# EAGLE design OneSLiPoCharger (EAGLE 8.2.0)

## Sheet 1 of 2: Low voltage cutoff 5V regulator
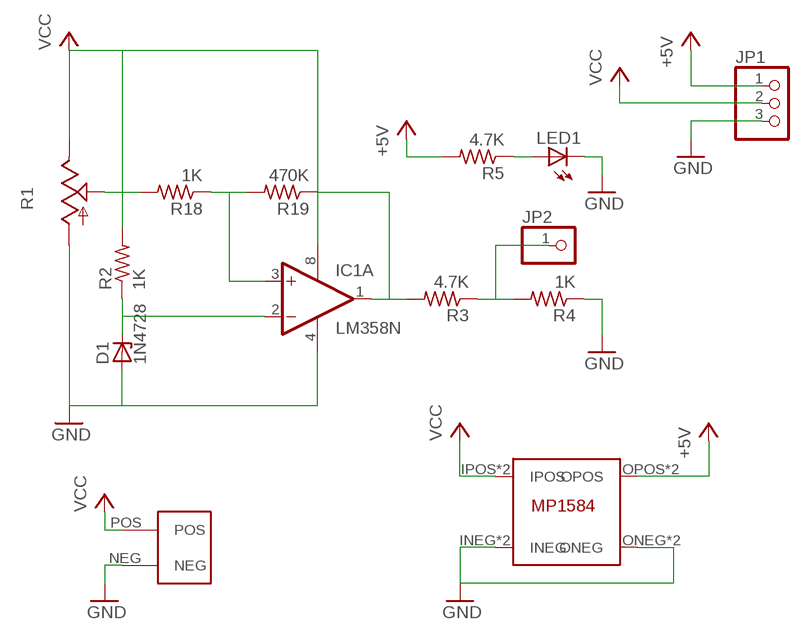
[diagram p0: schematic, sheet 1]

### Parts
D1  1N4728  [DO41Z10]
IC1  LM358N  [DIL08]
JP1  PINHD-1X3  [1X03]
JP2  PINHD-1X1  [1X01]
LED1  LED3MM  [LED3MM]
R1  TRIM_US-B25P  [B25P]
R2  1K  R-US_0207/10  [0207/10]
R3  4.7K  R-US_0207/10  [0207/10]
R4  1K  R-US_0207/10  [0207/10]
R5  4.7K  R-US_0207/10  [0207/10]
R18  1K  R-US_0207/10  [0207/10]
R19  470K  R-US_0207/10  [0207/10]
U$3  XT60  [XT60]
U$14  MP1584EN-MOD  [MP1584MOD-TH]

### Nets
+5V: JP1.1 R5.2 U$14.OPOS U$14.OPOS1(OPOS) ; also sheet 2
GND: D1.A IC1.4(P:V-) JP1.3 LED1.K(C) R1.A R4.1 U$3.NEG U$14.INEG U$14.INEG1(INEG) U$14.ONEG U$14.ONEG1(ONEG) ; also sheet 2
N$1: R1.S R18.2
N$2: JP2.1 R3.1 R4.2
N$3: D1.C IC1.2(A:-IN) R2.1
N$4: IC1.1(A:OUT) R3.2 R19.1
N$10: LED1.A R5.1
N$31: IC1.3(A:+IN) R18.1 R19.2
VCC: IC1.8(P:V+) JP1.2 R1.E R2.2 U$3.POS U$14.IPOS U$14.IPOS1(IPOS)
Unconnected: IC1.5(B:+IN) IC1.6(B:-IN) IC1.7(B:OUT)

## Sheet 2 of 2: 1S Lipo circuit
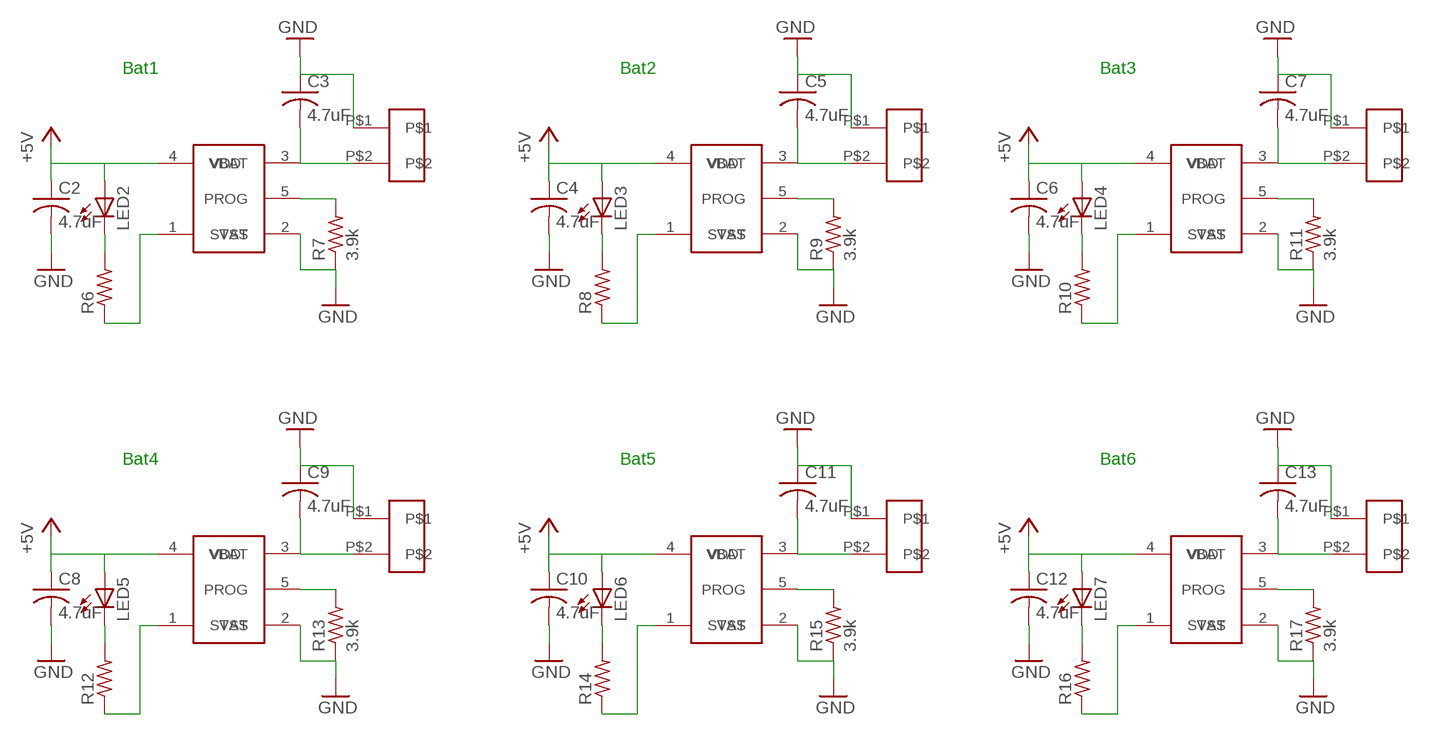
[diagram p1: schematic, sheet 2]

### Parts
C2  4.7uF  C-USC0805  [C0805]
C3  4.7uF  C-USC0805  [C0805]
C4  4.7uF  C-USC0805  [C0805]
C5  4.7uF  C-USC0805  [C0805]
C6  4.7uF  C-USC0805  [C0805]
C7  4.7uF  C-USC0805  [C0805]
C8  4.7uF  C-USC0805  [C0805]
C9  4.7uF  C-USC0805  [C0805]
C10  4.7uF  C-USC0805  [C0805]
C11  4.7uF  C-USC0805  [C0805]
C12  4.7uF  C-USC0805  [C0805]
C13  4.7uF  C-USC0805  [C0805]
LED2  LED3MM  [LED3MM]
LED3  LED3MM  [LED3MM]
LED4  LED3MM  [LED3MM]
LED5  LED3MM  [LED3MM]
LED6  LED3MM  [LED3MM]
LED7  LED3MM  [LED3MM]
R6  R-US_M0805  [M0805]
R7  3.9k  R-US_M0805  [M0805]
R8  R-US_M0805  [M0805]
R9  3.9k  R-US_M0805  [M0805]
R10  R-US_M0805  [M0805]
R11  3.9k  R-US_M0805  [M0805]
R12  R-US_M0805  [M0805]
R13  3.9k  R-US_M0805  [M0805]
R14  R-US_M0805  [M0805]
R15  3.9k  R-US_M0805  [M0805]
R16  R-US_M0805  [M0805]
R17  3.9k  R-US_M0805  [M0805]
U$1  MCP73831  [MCP73831-SOT23]
U$2  PICOBLADE-2PIN  [PICOBLADE-2PIN]
U$4  MCP73831  [MCP73831-SOT23]
U$5  PICOBLADE-2PIN  [PICOBLADE-2PIN]
U$6  MCP73831  [MCP73831-SOT23]
U$7  PICOBLADE-2PIN  [PICOBLADE-2PIN]
U$8  MCP73831  [MCP73831-SOT23]
U$9  PICOBLADE-2PIN  [PICOBLADE-2PIN]
U$10  MCP73831  [MCP73831-SOT23]
U$11  PICOBLADE-2PIN  [PICOBLADE-2PIN]
U$12  MCP73831  [MCP73831-SOT23]
U$13  PICOBLADE-2PIN  [PICOBLADE-2PIN]

### Nets
+5V: C2.1 C4.1 C6.1 C8.1 C10.1 C12.1 LED2.A LED3.A LED4.A LED5.A LED6.A LED7.A U$1.4(VDD) U$4.4(VDD) U$6.4(VDD) U$8.4(VDD) U$10.4(VDD) U$12.4(VDD) ; also sheet 1
GND: C2.2 C3.1 C4.2 C5.1 C6.2 C7.1 C8.2 C9.1 C10.2 C11.1 C12.2 C13.1 R7.1 R9.1 R11.1 R13.1 R15.1 R17.1 U$1.2(VSS) U$2.P$1 U$4.2(VSS) U$5.P$1 U$6.2(VSS) U$7.P$1 U$8.2(VSS) U$9.P$1 U$10.2(VSS) U$11.P$1 U$12.2(VSS) U$13.P$1 ; also sheet 1
N$6: LED2.K(C) R6.2
N$7: R6.1 U$1.1(STAT)
N$8: R7.2 U$1.5(PROG)
N$9: C3.2 U$1.3(VBAT) U$2.P$2
N$11: LED3.K(C) R8.2
N$12: R8.1 U$4.1(STAT)
N$13: R9.2 U$4.5(PROG)
N$14: C5.2 U$4.3(VBAT) U$5.P$2
N$15: LED4.K(C) R10.2
N$16: R10.1 U$6.1(STAT)
N$17: R11.2 U$6.5(PROG)
N$18: C7.2 U$6.3(VBAT) U$7.P$2
N$19: LED5.K(C) R12.2
N$20: R12.1 U$8.1(STAT)
N$21: R13.2 U$8.5(PROG)
N$22: C9.2 U$8.3(VBAT) U$9.P$2
N$23: LED6.K(C) R14.2
N$24: R14.1 U$10.1(STAT)
N$25: R15.2 U$10.5(PROG)
N$26: C11.2 U$10.3(VBAT) U$11.P$2
N$27: LED7.K(C) R16.2
N$28: R16.1 U$12.1(STAT)
N$29: R17.2 U$12.5(PROG)
N$30: C13.2 U$12.3(VBAT) U$13.P$2

### Notes on the sheet
- Bat1 | Bat2 | Bat3
- Bat4 | Bat5 | Bat6

## Library data of the parts
C2-C13 = rcl:C-US: CAPACITOR, American symbol
D1 = diode:1N4728: Z DIODE 3.3 V, 1W, 5 percent
IC1 = linear:LM358: OP AMP also LM158; LM258; LM2904 Source: http://cache.national.com/ds/LM/LM158.pdf
JP1 = pinhead:PINHD-1X3: PIN HEADER
JP2 = pinhead:PINHD-1X1: PIN HEADER
LED1-LED7 = led:LED: LED OSRAM: - CHIPLED LG R971, LG N971, LY N971, LG Q971, LY Q971, LO R971, LY R971 LH N974, LH R974 LS Q976, LO Q976, LY Q976 LO Q996 - Hyper CHIPLED LW Q18S LB Q993, LB Q99A, LB R99A - SideLED LS A670, LO A670, LY A670, LG A670, LP A670 LB A673, LV A673, LT A673, LW A673 LH A674 LY A675 LS A676, LA A676, LO A676, LY A676, LW A676 LS A679, LY A679, LG A679 - Hyper Micro SIDELED® LS Y876, LA Y876, LO Y876, LY Y876 LT Y87S - SmartLED LW L88C, LW L88S LB L89C, LB L89S, LG L890 LS L89K, LO L89K, LY L89K LS L896, LA L896, LO L896, LY L896 - TOPLED LS T670, LO T670, LY T670, LG T670, LP T670 LSG T670, LSP T670, LSY T670, LOP T670, LYG T670 LG T671, LOG T671, LSG T671 LB T673, LV T673, LT T673, LW T673 LH T674 LS T676, LA T676, LO T676, LY T676, LB T676, LH T676, LSB T676, LW T676 LB T67C, LV T67C, LT T67C, LS T67K, LO T67K, LY T67K, LW E67C LS E67B, LA E67B, LO E67B, LY E67B, LB E67C, LV E67C, LT E67C LW T67C LS T679, LY T679, LG T679 LS T770, LO T770, LY T770, LG T770, LP T770 LB T773, LV T773, LT T773, LW T773 LH T774 LS E675, LA E675, LY E675, LS T675 LS T776, LA T776, LO T776, LY T776, LB T776 LHGB T686 LT T68C, LB T68C - Hyper Mini TOPLED® LB M676 - Mini TOPLED Santana® LG M470 LS M47K, LO M47K, LY M47K Source: http://www.osram.convergy.de LUXEON: - LUMILED® LXK2-PW12-R00, LXK2-PW12-S00, LXK2-PW14-U00, LXK2-PW14-V00 LXK2-PM12-R00, LXK2-PM12-S00, LXK2-PM14-U00 LXK2-PE12-Q00, LXK2-PE12-R00, LXK2-PE12-S00, LXK2-PE14-T00, LXK2-PE14-U00 LXK2-PB12-K00, LXK2-PB12-L00, LXK2-PB12-M00, LXK2-PB14-N00, LXK2-PB14-P00, LXK2-PB14-Q00 LXK2-PR12-L00, LXK2-PR12-M00, LXK2-PR14-Q00, LXK2-PR14-R00 LXK2-PD12-Q00, LXK2-PD12-R00, LXK2-PD12-S00 LXK2-PH12-R00, LXK2-PH12-S00 LXK2-PL12-P00, LXK2-PL12-Q00, LXK2-PL12-R00 Source: www.luxeon.com KINGBRIGHT: KA-3528ASYC Source: www.kingbright.com
R1 = pot:TRIM_US-: POTENTIOMETER
R2-R19 = rcl:R-US_: RESISTOR, American symbol
U$1 U$4 U$6 U$8 U$10 U$12 = MCP73831:MCP73831
U$2 U$5 U$7 U$9 U$11 U$13 = Picoblade:PICOBLADE-2PIN
U$3 = XTConnector:XT60
U$14 = VRegModules:MP1584EN-MOD

## Board
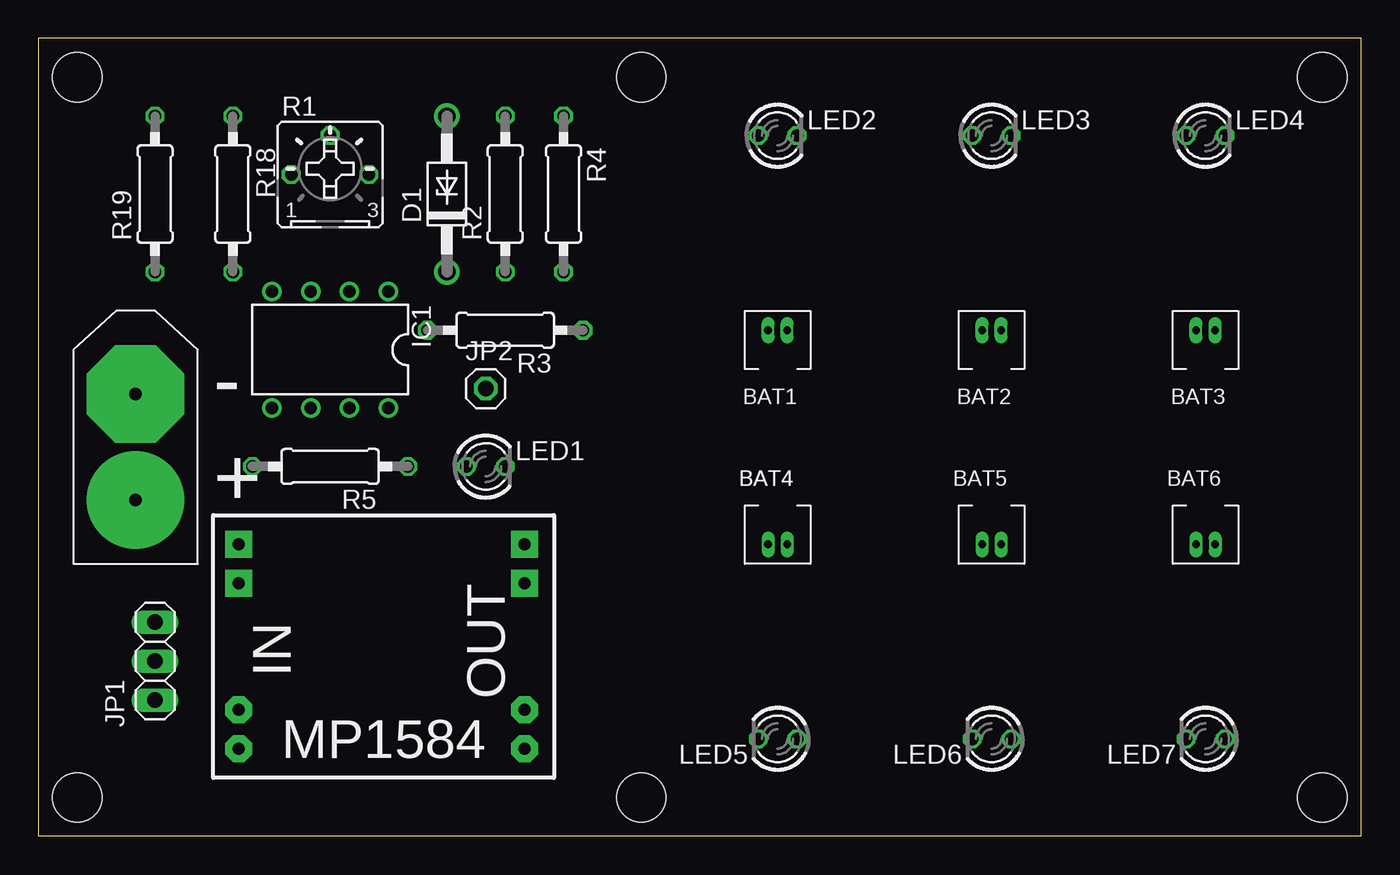
[diagram p2: board, top side]
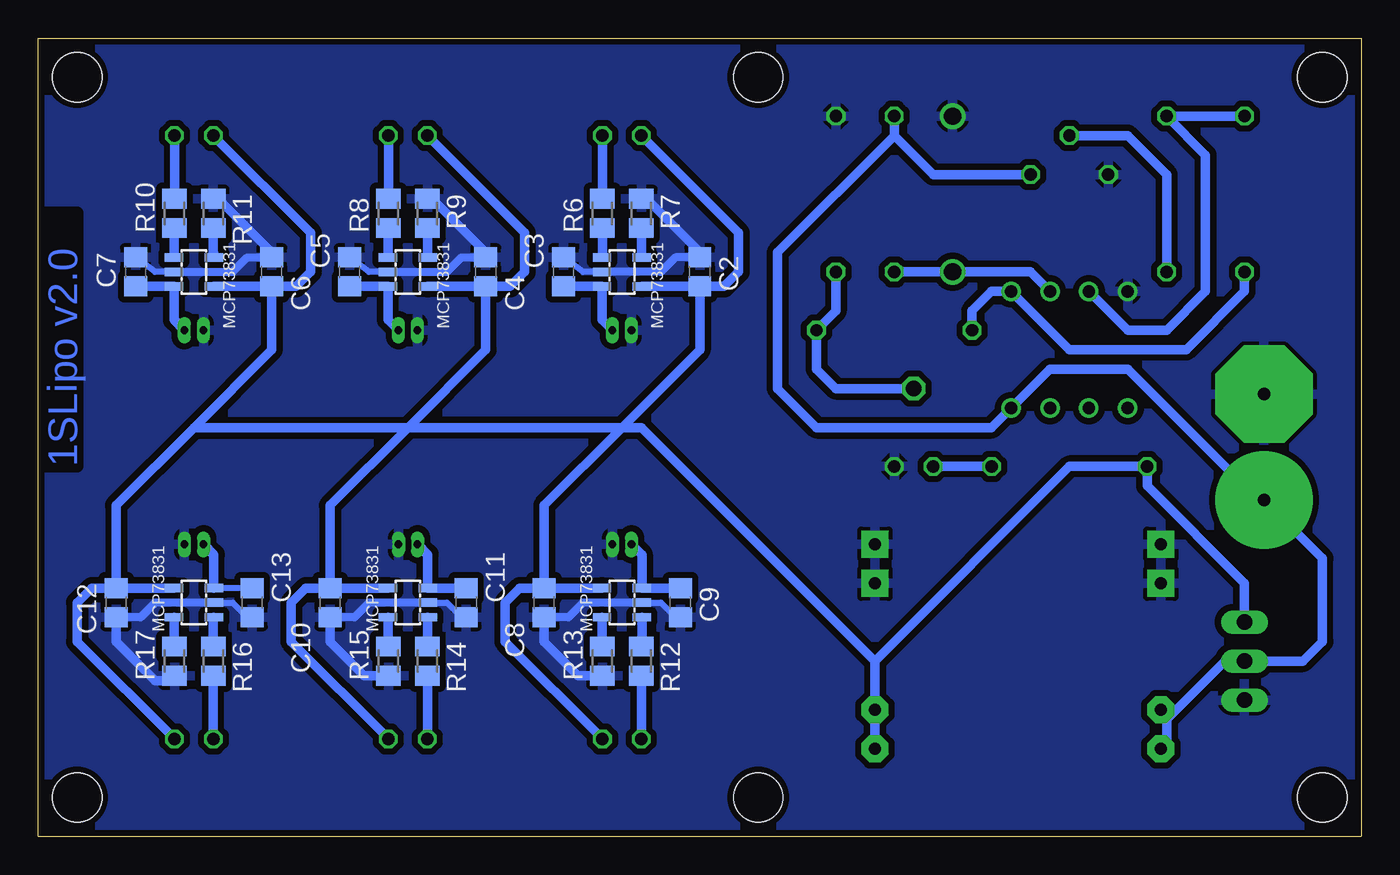
[diagram p3: board, bottom side, seen from below]

Size 86.36 x 52.07 mm. Coordinates in mm from the lower left corner, seen from the top.
Outline: 86.36,0 86.36,52.07 0,52.07 0,0 86.36,0
Copper layers (1*16): Top 0.0356mm / dielectric 1.5011mm / Bottom 0.0356mm
Design rules "LaenPCBOrder": minimum track width 6mil, minimum drill 13mil, track to track 6mil, track to pad 6mil, pad to pad 6mil, via to via 6mil, smd to smd 6mil, copper to edge 15mil, drill to drill 6mil, minimum pad ring 7mil, minimum via ring 7mil, stop-mask expansion 3mil, vias tented up to drill 0mil, thermal gap 10mil
Holes 3.2 mm at 2.54,2.54 2.54,49.53 83.82,49.53 83.82,2.54 39.37,49.53 39.37,2.54

### Footprints (pad centres in the part's own frame; a part is rotated, then mirrored left to right if it is on the bottom)
C0805 = smd 1.3 x 1.5: 1 -0.95,0; 2 0.95,0
DO41Z10 = drill 1.118: A 5.08,0; C -5.08,0
DIL08 = drill 0.813 pad 1.27: 1 -3.81,-3.81; 2 -1.27,-3.81; 3 1.27,-3.81; 4 3.81,-3.81; 5 3.81,3.81; 6 1.27,3.81; 7 -1.27,3.81; 8 -3.81,3.81
1X03 = drill 1.016 long: 1 -2.54,0; 2 0,0; 3 2.54,0
1X01 = drill 1.016 octagon: 1 0,0
LED3MM = drill 0.813 octagon: A -1.27,0; K 1.27,0
B25P = drill 0.813 octagon: A -2.54,0; E 2.54,0; S 0,2.54
0207/10 = drill 0.813 octagon: 1 -5.08,0; 2 5.08,0
M0805 = smd 1.3 x 1.6: 1 -0.95,0; 2 0.95,0
MCP73831-SOT23 = smd 0.55 x 1.2: 1 -0.95,-1.3; 2 0,-1.3; 3 0.95,-1.3; 4 0.95,1.3; 5 -0.95,1.3
PICOBLADE-2PIN = drill 0.5 pad 0.711 long: P$1 -0.625,0; P$2 0.625,0
XT60 = drill 0.8 pad 6.35 octagon: NEG 0,3.454 | drill 0.8 pad 6.35: POS 0,-3.454
MP1584MOD-TH = drill 0.8 pad 1.778 square: INEG 18.669,0; INEG1 18.669,2.54; ONEG 0,0; ONEG1 0,2.54 | drill 0.8 pad 1.778 octagon: IPOS 18.669,13.335; IPOS1 18.669,10.795; OPOS 0,13.335; OPOS1 0,10.795

### Placement (x,y rotation side)
C2  43.18,36.83 90 bottom
C3  52.07,36.83 270 bottom
C4  57.15,36.83 90 bottom
C5  66.04,36.83 270 bottom
C6  71.12,36.83 90 bottom
C7  80.01,36.83 270 bottom
C8  53.34,15.24 270 bottom
C9  44.45,15.24 90 bottom
C10  67.31,15.24 270 bottom
C11  58.42,15.24 90 bottom
C12  81.28,15.24 270 bottom
C13  72.39,15.24 90 bottom
D1  26.67,41.91 90 top
DRILEGEND  [DRILEGEND]  -17.78,-9.8 0 top  (outside the outline)
IC1  19.05,31.75 180 top
JP1  7.62,11.43 270 top
JP2  29.21,29.21 0 top
LED1  29.21,24.13 0 top
LED2  48.26,45.72 0 top
LED3  62.23,45.72 0 top
LED4  76.2,45.72 0 top
LED5  48.26,6.35 180 top
LED6  62.23,6.35 180 top
LED7  76.2,6.35 180 top
R1  19.05,43.18 0 top
R2  30.48,41.91 90 top
R3  30.48,33.02 180 top
R4  34.29,41.91 270 top
R5  19.05,24.13 180 top
R6  49.53,40.64 90 bottom
R7  46.99,40.64 270 bottom
R8  63.5,40.64 90 bottom
R9  60.96,40.64 270 bottom
R10  77.47,40.64 90 bottom
R11  74.93,40.64 270 bottom
R12  46.99,11.43 270 bottom
R13  49.53,11.43 90 bottom
R14  60.96,11.43 270 bottom
R15  63.5,11.43 90 bottom
R16  74.93,11.43 270 bottom
R17  77.47,11.43 90 bottom
R18  12.7,41.91 270 top
R19  7.62,41.91 90 top
U$1  48.26,36.83 270 bottom
U$2  48.26,33.02 0 top
U$3  6.35,25.4 0 top
U$4  62.23,36.83 270 bottom
U$5  62.23,33.02 0 top
U$6  76.2,36.83 270 bottom
U$7  76.2,33.02 0 top
U$8  48.26,15.24 90 bottom
U$9  48.26,19.05 180 top
U$10  62.23,15.24 90 bottom
U$11  62.23,19.05 180 top
U$12  76.2,15.24 90 bottom
U$13  76.2,19.05 180 top
U$14  31.75,19.05 180 top

### Tracks (layer width: path | path; a pad name or v marks a point on that pad's centre or on a via)
+5V
  Bottom 0.61: C2.1 U$1.4 | LED2.A 40.64,39.37 40.64,36.83 41.59,35.88 C2.1 | C4.1 U$4.4 | LED3.A 54.61,39.37 54.61,36.83 55.56,35.88 C4.1 | U$6.4 C6.1 | LED4.A 68.58,39.37 68.58,36.83 69.53,35.88 C6.1 | C8.1 U$8.4 | C8.1 54.93,16.19 55.88,15.24 55.88,12.7 LED5.A | U$10.4 C10.1 | C10.1 68.9,16.19 69.85,15.24 69.85,12.7 LED6.A | U$12.4 C12.1 | C12.1 82.87,16.19 83.82,15.24 83.82,12.7 LED7.A | C8.1 53.34,21.59 48.26,26.67 | C12.1 81.28,21.59 76.2,26.67 | C6.1 71.12,31.75 76.2,26.67 | C10.1 67.31,21.59 62.23,26.67 | C4.1 57.15,31.75 62.23,26.67 | 76.2,26.67 62.23,26.67 | C2.1 43.18,31.75 48.26,26.67 | 48.26,26.67 62.23,26.67 | 48.26,26.67 46.99,26.67 31.75,11.43 | JP1.1 7.62,16.51 13.97,22.86 R5.2 19.05,24.13 31.75,11.43 | 31.75,11.43 U$14.OPOS1 U$14.OPOS
GND
  Bottom 0.406: U$1.2 50.8,36.83 C3.1 | U$4.2 64.77,36.83 C5.1 | U$6.2 78.74,36.83 C7.1 | U$12.2 73.66,15.24 72.71,14.29 | U$10.2 59.69,15.24 58.74,14.29 | U$8.2 45.72,15.24 44.77,14.29
  Bottom 0.508: C2.2 44.77,37.78 45.72,36.83 U$1.2 | U$4.2 59.69,36.83 58.74,37.78 C4.2 | U$6.2 73.66,36.83 72.71,37.78 C6.2 | U$10.2 64.77,15.24 65.72,14.29 C10.2 | U$12.2 78.74,15.24 79.69,14.29 C12.2 | U$8.2 50.8,15.24 51.75,14.29 C8.2
  Bottom 0.61: R7.1 46.67,41.59 43.18,38.1 C2.2 | C4.2 57.15,38.1 60.64,41.59 R9.1 | C6.2 71.12,38.1 74.61,41.59 R11.1 | 81.28,13.97 C12.2 81.28,12.7 78.74,10.16 77.79,10.16 R17.1 77.47,10.16 | 72.71,14.29 C13.1 | 58.74,14.29 C11.1 | C10.2 67.31,12.7 65.09,10.48 R15.1 | 44.77,14.29 C9.1 | C8.2 53.34,12.7 51.12,10.48 R13.1
  pour Bottom (isolate 0.406): 0,0 86.36,0 86.36,52.07 0,52.07
N$1
  Bottom 0.61: R18.2 12.7,43.18 15.24,45.72 R1.S
N$2
  Bottom 0.61: R4.2 34.29,34.29 R3.1 35.56,30.48 34.29,29.21 JP2.1
N$3
  Bottom 0.61: IC1.2 21.59,36.83 D1.C R2.1
N$4
  Bottom 0.61: R19.1 7.62,35.56 11.43,31.75 19.05,31.75 IC1.1 24.13,35.56 25.4,34.29 R3.2
N$6
  Bottom 0.61: LED2.K R6.2
N$7
  Bottom 0.61: U$1.1 49.53,37.81 R6.1
N$8
  Bottom 0.61: U$1.5 46.99,37.81 R7.2
N$9
  Bottom 0.61: C3.2 U$1.3 49.56,33.7 U$2.P$2
N$10
  Bottom 0.61: R5.1 LED1.A
N$11
  Bottom 0.61: LED3.K R8.2
N$12
  Bottom 0.61: R8.1 63.53,39.69 U$4.1
N$13
  Bottom 0.406: R9.2 60.93,39.69
  Bottom 0.61: 60.93,39.69 U$4.5
N$14
  Bottom 0.61: 66.04,35.56 C5.2 U$4.3 63.53,33.7 U$5.P$2
N$15
  Bottom 0.61: LED4.K R10.2
N$16
  Bottom 0.61: R10.1 77.5,39.66 U$6.1
N$17
  Bottom 0.61: U$6.5 74.9,38.07 74.93,38.1 R11.2
N$18
  Bottom 0.61: C7.2 U$6.3 77.5,33.7 U$7.P$2
N$19
  Bottom 0.61: LED5.K R12.2
N$20
  Bottom 0.61: R12.1 46.96,12.41 U$8.1
N$21
  Bottom 0.61: U$8.5 49.56,12.38 R13.2
N$22
  Bottom 0.61: U$9.P$2 46.96,18.38 U$8.3 C9.2
N$23
  Bottom 0.61: LED6.K R14.2
N$24
  Bottom 0.61: R14.1 60.96,14.26 U$10.1
N$25
  Bottom 0.61: U$10.5 63.53,12.41 R15.2
N$26
  Bottom 0.61: U$11.P$2 60.93,18.38 U$10.3 C11.2
N$27
  Bottom 0.61: LED7.K R16.2
N$28
  Bottom 0.61: R16.1 74.93,14.26 U$12.1
N$29
  Bottom 0.61: U$12.5 77.5,12.41 R17.2
N$30
  Bottom 0.406: C13.2 U$12.3
  Bottom 0.61: U$12.3 74.9,18.38 U$13.P$2
N$31
  Bottom 0.61: R19.2 R18.1 10.16,44.45 10.16,35.56 12.7,33.02 15.24,33.02 IC1.3
VCC
  Bottom 0.61: R1.E 27.94,43.18 30.48,45.72 | 12.7,7.62 8.89,11.43 JP1.2 3.81,11.43 2.54,12.7 2.54,18.14 U$3.POS 6.71,21.95 15.24,30.48 20.32,30.48 IC1.8 24.13,26.67 35.56,26.67 38.1,29.21 38.1,38.1 30.48,45.72 | 12.7,7.62 12.7,6.35 U$14.IPOS | R2.2 30.48,45.72 | U$14.IPOS1 13.08,8 12.7,7.62

### Text on the board
Bottom: 1SLipo v2.0
tPlace: BAT1 | BAT2 | BAT3 | BAT4 | BAT5 | BAT6
tNames: BAT4